# EAGLE schematic BPR-301 Circuit (EAGLE 9.4.2)
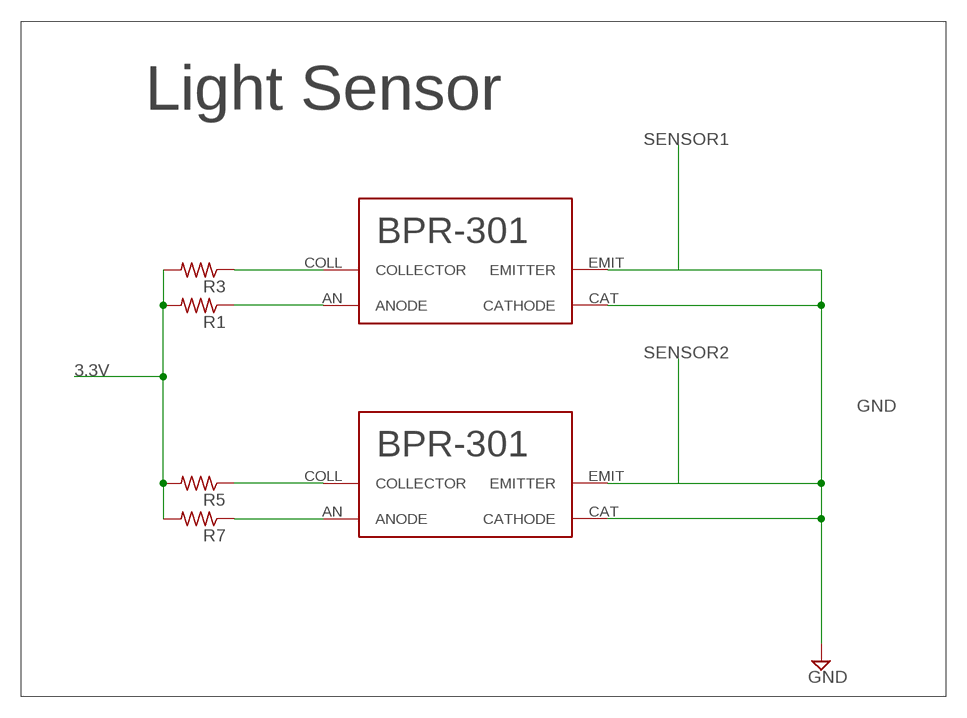
[diagram p0: schematic, sheet 1]

## Parts
R1  R-US_R0402  [R0402]
R3  R-US_R0402  [R0402]
R5  R-US_R0402  [R0402]
R7  R-US_R0402  [R0402]
U$1  BPR-301  [BPR-301]
U$2  BPR-301  [BPR-301]

## Nets
3.3V: R1.2 R3.2 R5.2 R7.2
GND: U$1.CAT(CATHODE) U$1.EMIT(EMITTER) U$2.CAT(CATHODE) U$2.EMIT(EMITTER)
N$1: R3.1 U$2.COLL(COLLECTOR)
N$2: R1.1 U$2.AN(ANODE)
N$3: R5.1 U$1.COLL(COLLECTOR)
N$4: R7.1 U$1.AN(ANODE)

## Notes on the sheet
- Light Sensor

## Library data of the parts
R1 R3 R5 R7 = rcl:R-US_: RESISTOR, American symbol; SPICEPREFIX: R
U$1 U$2 = BPR-301:BPR-301